# Altium schematic sheet NetTieLibSample.SchDoc: Edit Document Parameters
size A4; CheckedBy: Edit; Author: Edit; DocumentNumber: ID1; Revision: 1.0a; SheetNumber: 1; SheetTotal: 1; PageSetup: Record=PageOptions|CenterHorizontal=True|CenterVertical=True|PrintScale=1.00|XCorrection=1.00|YCorrection=1.00|PrintKind=0|BorderSize=5000000|LeftOffset=0|BottomOffset=0|Orientation=2|PaperLength=1000|PaperWidth=1000|Scale=100|PaperSource=7|PrintQuality=-4|MediaType=1|DitherType=10|PaperKind=A3 297 x 420 mm|PrintScaleMode=1
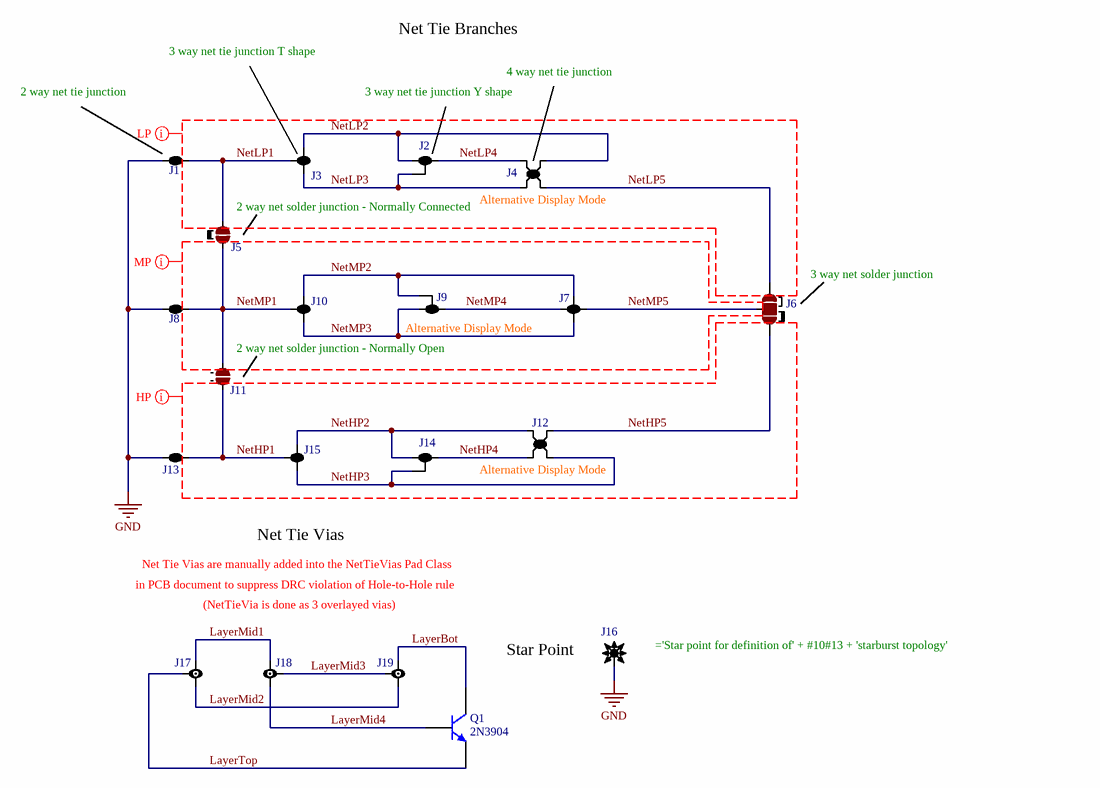
[diagram p0: NetTieLibSample.SchDoc]

## Parts
J1  2 way net tie junction  [2way_LP]  (value not drawn)  (net tie, no BOM)
J2  3 way net tie junction Y shape  [3wayY_LP]  (value not drawn)  (net tie, no BOM)
J3  3 way net tie junction T shape  [3wayT_LP]  (value not drawn)  (net tie, no BOM)
J4  4 way net tie junction  [4way_LP]  (value not drawn)  (net tie, no BOM)
J5  2 way net solder junction - Normally Connected  [2waySolder_NC]  (value not drawn)  (no BOM)
J6  3 way net solder junction  [3waySolder]  (value not drawn)  (no BOM)
J7  4 way net tie junction  [4way_MP]  (value not drawn)  (net tie, no BOM)
J8  2 way net tie junction  [2way_MP]  (value not drawn)  (net tie, no BOM)
J9  3 way net tie junction Y shape  [3wayY_MP]  (value not drawn)  (net tie, no BOM)
J10  3 way net tie junction T shape  [3wayT_MP]  (value not drawn)  (net tie, no BOM)
J11  2 way net solder junction - Normally Open  [2waySolder_NO]  (value not drawn)  (no BOM)
J12  4 way net tie junction  [4way_HP]  (value not drawn)  (net tie, no BOM)
J13  2 way net tie junction  [2way_HP]  (value not drawn)  (net tie, no BOM)
J14  3 way net tie junction Y shape  [3wayY_HP]  (value not drawn)  (net tie, no BOM)
J15  3 way net tie junction T shape  [3wayT_HP]  (value not drawn)  (net tie, no BOM)
J16  (no value)  [StarPoint]  (no BOM)
J17  Net Tie Via  [NetTieVia03]  (value not drawn)  (net tie, no BOM)
J18  Net Tie Via  [NetTieVia06]  (value not drawn)  (net tie, no BOM)
J19  Net Tie Via  [NetTieVia08]  (value not drawn)  (net tie, no BOM)
Q1  2N3904  [TO-92A]

## Nets
GND: J1.1 J8.1 J13.1 J16.1
LayerBot: J19.2 Q1.3(C)
LayerMid1: J17.2 J18.2
LayerMid2: J17.3 J19.3
LayerMid3: J18.1 J19.1
LayerMid4: J18.3 Q1.2(B)
LayerTop: J17.1 Q1.1(E)
NetHP1: J11.2 J13.2 J15.1
NetHP2: J12.2 J14.3 J15.2
NetHP3: J12.3 J14.2 J15.3
NetHP4: J12.1 J14.1
NetHP5: J6.1 J12.4
NetLP1: J1.2 J3.1 J5.1
NetLP2: J2.3 J3.2 J4.4
NetLP3: J2.2 J3.3 J4.1
NetLP4: J2.1 J4.2
NetLP5: J4.3 J6.3
NetMP1: J5.2 J8.2 J10.1 J11.1
NetMP2: J7.2 J9.3 J10.2
NetMP3: J7.3 J9.2 J10.3
NetMP4: J7.1 J9.1
NetMP5: J6.2 J7.4

## Layout directives
rule Width Constraint [Pref Width = 12mil    Min Width = 12mil    Max Width = 120mil]; net class LP: NetLP1, NetLP2, NetLP3, NetLP4, NetLP5
rule Width Constraint [Pref Width = 40mil    Min Width = 12mil    Max Width = 120mil]; net class MP: NetMP1, NetMP2, NetMP3, NetMP4, NetMP5
rule Width Constraint [Pref Width = 120mil    Min Width = 12mil    Max Width = 120mil]; net class HP: NetHP1, NetHP2, NetHP3, NetHP4, NetHP5

## Notes on the sheet
- 3 way net tie junction T shape
- Net Tie Branches
- 2 way net tie junction
- 3 way net tie junction Y shape
- 4 way net tie junction
- 2 way net solder junction - Normally Connected
- (near J4) Alternative Display Mode
- (near J9) Alternative Display Mode
- (near J6) 3 way net solder junction
- (near J11) 2 way net solder junction - Normally Open
- Net Tie Vias
- (near J12) Alternative Display Mode
- in PCB document to suppress DRC violation of Hole-to-Hole rule
- Net Tie Vias are manually added into the NetTieVias Pad Class
- (NetTieVia is done as 3 overlayed vias)
- (near J16) Star Point

## Library data of the parts
J1 J8 J13 = 2way: ComponentLink1URL: http://www.edatools.cz/addons; ComponentLink1Description: Source
J2 J9 J14 = 3wayY: ComponentLink1URL: http://www.edatools.cz/addons; ComponentLink1Description: Source
J3 J10 J15 = 3wayT: Note: 2 display modes available; ComponentLink1URL: http://www.edatools.cz/addons; ComponentLink1Description: Source
J4 J7 J12 = 4way: Note: 2 display modes available; ComponentLink1URL: http://www.edatools.cz/addons; ComponentLink1Description: Source
J5 = 2waySolderNC: ComponentLink1URL: http://www.edatools.cz/addons; ComponentLink1Description: Source
J6 = 3waySolder: ComponentLink1URL: http://www.edatools.cz/addons; ComponentLink1Description: Source
J11 = 2waySolderNO: ComponentLink1URL: http://www.edatools.cz/addons; ComponentLink1Description: Source
J16 = StarPoint: Star point for definition of starburst topology; Note: Add routing topology rule in PCB to desired net; ComponentLink1URL: http://www.edatools.cz/addons; ComponentLink1Description: Source
J17-J19 = NetTieVia: ComponentLink1URL: http://www.edatools.cz/addons; ComponentLink1Description: Source
Q1 = 2N3904: NPN General Purpose Amplifier; Published: 8-Jun-2000; LatestRevisionDate: 15-Jan-2003; LatestRevisionNote: PCB Footprint 'BCY-W3/D4.7' replaced; DatasheetVersion: 1997; PackageVersion: Sep-1998; PackageReference: TO-92A; Publisher: Altium Limited; PackageDescription: TO, Flat Index; 3 In-Line, Axial Leads; Body Dia. 4.5mm; Leads 0.51 x 0.48 mm (max); ComponentLink1Description: Manufacturer Link; ComponentLink1URL: http://www.fairchildsemi.com/; ComponentLink2Description: Datasheet; ComponentLink2URL: http://www.fairchildsemi.com/ds/2N%2F2N3904.pdf